# Altium schematic sheet Power_Supply_Schematic.SchDoc
size A4; DocumentNumber: 2; SheetNumber: 2; SheetTotal: 5
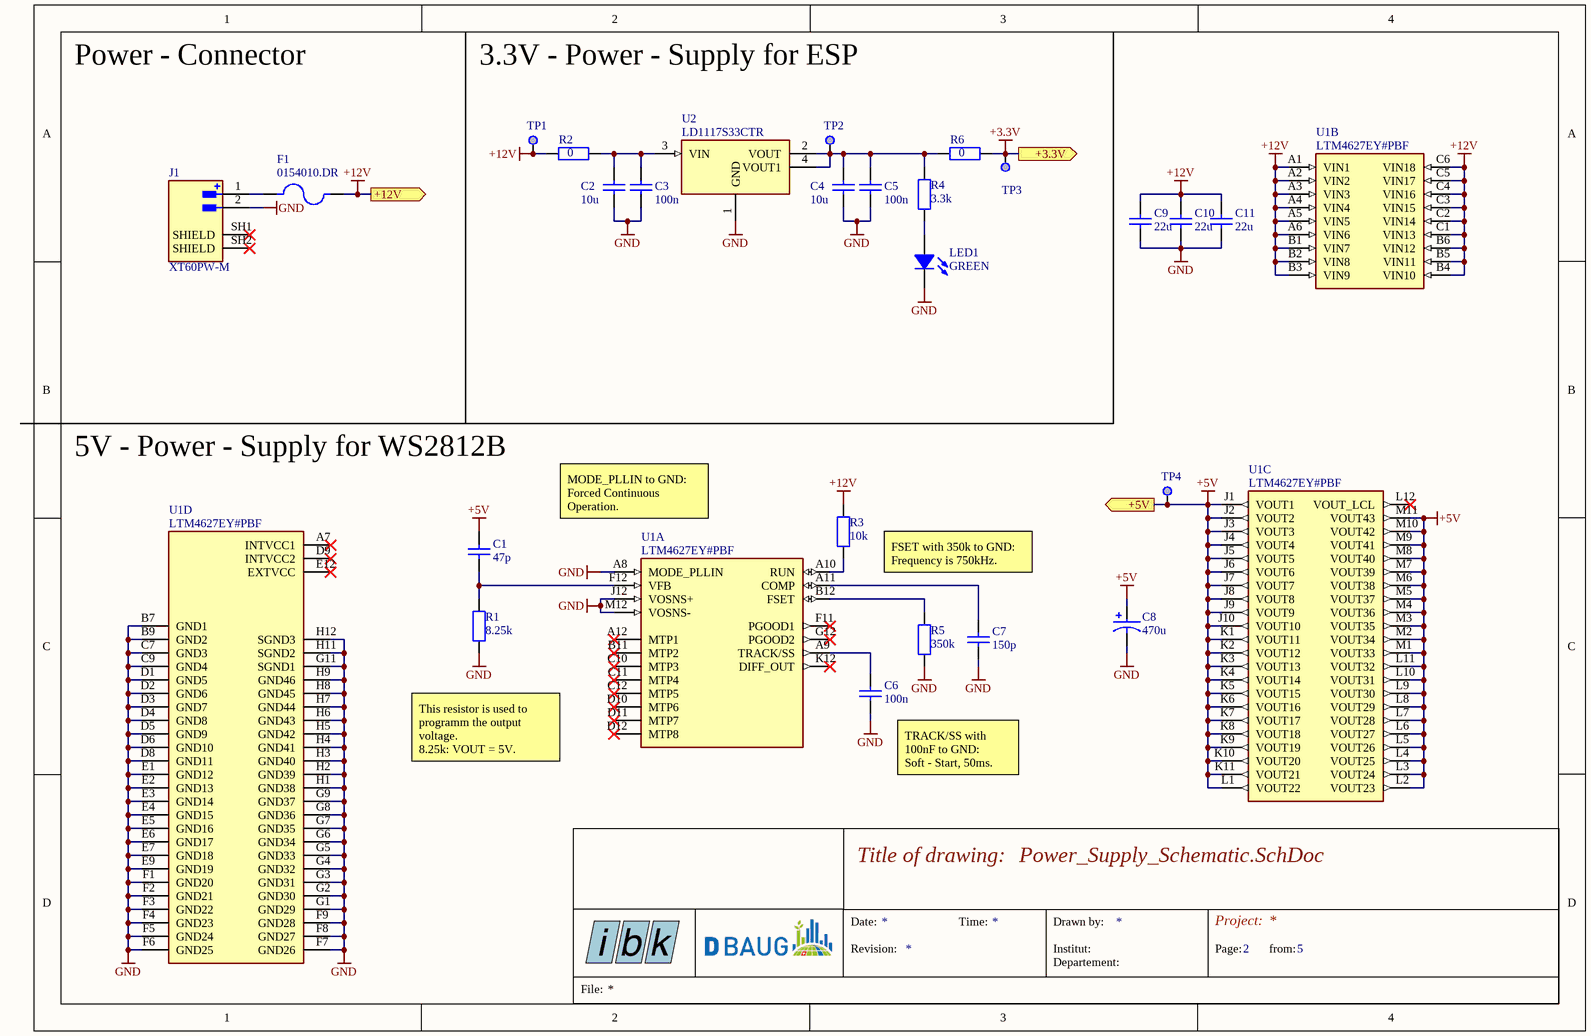
[diagram p0: Power_Supply_Schematic.SchDoc]

## Parts
C1  47p  [0603_CAPACITOR]
C2  10u  [Capacitor_0805]
C3  100n  [0603_CAPACITOR]
C4  10u  [Capacitor_0805]
C5  100n  [0603_CAPACITOR]
C6  100n  [0603_CAPACITOR]
C7  150p  [0603_CAPACITOR]
C8  470u  [Capacitor_Tantalum]
C9  22u  [Capacitor_0805]
C10  22u  [Capacitor_0805]
C11  22u  [Capacitor_0805]
F1  0154010.DR  [Fuse]
J1  XT60PW-M  [PCB_Connector]
LED1  GREEN  [LED_0603, GREEN]
R1  8.25k  [Resistor_0603]
R2  0  [1206_Resistor]
R3  10k  [Resistor_0603]
R4  3.3k  [Resistor_0603]
R5  350k  [Resistor_0603]
R6  0  [1206_Resistor]
TP1  Testpoint S2761-46R  [Testpoint S2761-46R]  (value not drawn)
TP2  Testpoint S2761-46R  [Testpoint S2761-46R]  (value not drawn)
TP3  Testpoint S2761-46R  [Testpoint S2761-46R]  (value not drawn)
TP4  Testpoint S2761-46R  [Testpoint S2761-46R]  (value not drawn)
U1  LTM4627EY#PBF  [DCDC_Converter]  (parts A,B,C,D of 4)
U2  LD1117S33CTR  [LD1117S33CTR]

## Ports
+3.3V (out), +5V (out), +12V (out)

## Nets
+3.3V: R6.2 TP3.1 ; port +3.3V
+5V: C1.2 C8.1 TP4.1 U1.J1(VOUT1) U1.J2(VOUT2) U1.J3(VOUT3) U1.J4(VOUT4) U1.J5(VOUT5) U1.J6(VOUT6) U1.J7(VOUT7) U1.J8(VOUT8) U1.J9(VOUT9) U1.J10(VOUT10) U1.K1(VOUT11) U1.K2(VOUT12) U1.K3(VOUT13) U1.K4(VOUT14) U1.K5(VOUT15) U1.K6(VOUT16) U1.K7(VOUT17) U1.K8(VOUT18) U1.K9(VOUT19) U1.K10(VOUT20) U1.K11(VOUT21) U1.L1(VOUT22) U1.L2(VOUT23) U1.L3(VOUT24) U1.L4(VOUT25) U1.L5(VOUT26) U1.L6(VOUT27) U1.L7(VOUT28) U1.L8(VOUT29) U1.L9(VOUT30) U1.L10(VOUT31) U1.L11(VOUT32) U1.M1(VOUT33) U1.M2(VOUT34) U1.M3(VOUT35) U1.M4(VOUT36) U1.M5(VOUT37) U1.M6(VOUT38) U1.M7(VOUT39) U1.M8(VOUT40) U1.M9(VOUT41) U1.M10(VOUT42) U1.M11(VOUT43) ; port +5V
+12V: C9.2 C10.2 C11.2 F1.2 R2.1 R3.2 TP1.1 U1.A1(VIN1) U1.A2(VIN2) U1.A3(VIN3) U1.A4(VIN4) U1.A5(VIN5) U1.A6(VIN6) U1.B1(VIN7) U1.B2(VIN8) U1.B3(VIN9) U1.B4(VIN10) U1.B5(VIN11) U1.B6(VIN12) U1.C1(VIN13) U1.C2(VIN14) U1.C3(VIN15) U1.C4(VIN16) U1.C5(VIN17) U1.C6(VIN18) ; port +12V
GND: C2.1 C3.1 C4.1 C5.1 C6.1 C7.1 C8.2 C9.1 C10.1 C11.1 J1.2(N) LED1.K R1.1 R5.1 U1.A8(MODE_PLLIN) U1.B7(GND1) U1.B9(GND2) U1.C7(GND3) U1.C9(GND4) U1.D1(GND5) U1.D2(GND6) U1.D3(GND7) U1.D4(GND8) U1.D5(GND9) U1.D6(GND10) U1.D8(GND11) U1.E1(GND12) U1.E2(GND13) U1.E3(GND14) U1.E4(GND15) U1.E5(GND16) U1.E6(GND17) U1.E7(GND18) U1.E9(GND19) U1.F1(GND20) U1.F2(GND21) U1.F3(GND22) U1.F4(GND23) U1.F5(GND24) U1.F6(GND25) U1.F7(GND26) U1.F8(GND27) U1.F9(GND28) U1.G1(GND29) U1.G2(GND30) U1.G3(GND31) U1.G4(GND32) U1.G5(GND33) U1.G6(GND34) U1.G7(GND35) U1.G8(GND36) U1.G9(GND37) U1.G11(SGND1) U1.H1(GND38) U1.H2(GND39) U1.H3(GND40) U1.H4(GND41) U1.H5(GND42) U1.H6(GND43) U1.H7(GND44) U1.H8(GND45) U1.H9(GND46) U1.H11(SGND2) U1.H12(SGND3) U1.J12(VOSNS+) U1.M12(VOSNS-) U2.1(GND)
NetC1_1: C1.1 R1.2 U1.F12(VFB)
NetC2_2: C2.2 C3.2 R2.2 U2.3(VIN)
NetC4_2: C4.2 C5.2 R4.2 R6.1 TP2.1 U2.2(VOUT) U2.4(VOUT1)
NetC6_2: C6.2 U1.A9(TRACK/SS)
NetC7_2: C7.2 U1.A11(COMP)
NetF1_1: F1.1 J1.1(P)
NetLED1_A: LED1.A R4.1
NetR3_1: R3.1 U1.A10(RUN)
NetR5_2: R5.2 U1.B12(FSET)

Not connected (* = marked no-connect by the designer): J1 SH1(SHIELD)* SH2(SHIELD)*; U1 A7(INTVCC1)* A12(MTP1)* B11(MTP2)* C10(MTP3)* C11(MTP4)* C12(MTP5)* D9(INTVCC2)* D10(MTP6)* D11(MTP7)* D12(MTP8)* E12(EXTVCC)* F11(PGOOD1)* G12(PGOOD2)* K12(DIFF_OUT)* L12(VOUT_LCL)*

## Notes on the sheet
- Power - Connector
- 3.3V - Power - Supply for ESP
- 5V - Power - Supply for WS2812B
- MODE_PLLIN to GND:
  Forced Continuous Operation.
- FSET with 350k to GND:
  Frequency is 750kHz.
- This resistor is used to programm the output voltage.
  8.25k: VOUT = 5V.
- (near C6) TRACK/SS with 100nF to GND:
  Soft - Start, 50ms.
- Date:
- Title of drawing:
- Time:
- Drawn by:
- Project:
- Revision:
- Institut:
- Departement:
- Page:
- from:
- File:

## Library data of the parts
C1 C3 C5-C7 = Capacitor: 0603
C2 C4 C9-C11 = Capacitor_0805: 0805
C8 = Capacitor_Tantalum: 470 µF Molded Tantalum Capacitors 6.3 V 2917 (7343 Metric) 100mOhm.
F1 = Fuse: FUSE BRD MNT 10A 125VAC/VDC SMD | Littelfuse 0154010.DR.
J1 = PCB_Connector: Socket, DC supply, male, PIN: 2.; MF: AMASS; SnapEDA_Link: https://www.snapeda.com/parts/XT60PW-M/AMASS/view-part/?ref=snap; Package: Package; Value: *; MP: XT60PW-M; Check_prices: https://www.snapeda.com/parts/XT60PW-M/AMASS/view-part/?ref=eda
LED1 = LED_0603, GREEN: LED 0603, Green, 3.2 V, 20 mA, 430 mcd
R1 R3-R5 = Resistor_0603: 0603
R2 R6 = Resistor_1206: 1206
TP1-TP4 = Testpoint S2761-46R: Prüfstecker und Messbuchsen EZ BoardWare S27 SMT Mini Test Terminal, Reel
U1 = DCDC_Converter: Module DC-DC 1-OUT 0.6V to 5V 15A Automotive 133-Pin BGA Tray.; MF: Analog Devices; SnapEDA_Link: https://www.snapeda.com/parts/LTM4627EY%23PBF/Analog+Devices/view-part/?ref=snap; Availability: In Stock; Purchase-URL: https://pricing.snapeda.com/search/part/LTM4627EY#PBF/?ref=eda; Check_prices: https://www.snapeda.com/parts/LTM4627EY%23PBF/Analog+Devices/view-part/?ref=eda; Value: *; Package: BGA -133 Analog Devices; MP: LTM4627EY#PBF; Price: None
U2 = LD1117S33CTR: LDO, 3.3V and 800mA.; ComponentLink1Description: Datasheet; ComponentLink1URL: chrome-extension://efaidnbmnnnibpcajpcglclefindmkaj/https://www.st.com/content/ccc/resource/technical/document/datasheet/99/3b/7d/91/91/51/4b/be/CD00000544.pdf/files/CD00000544.pdf/jcr:content/translations/en.CD00000544.pdf; ComponentLink2Description: Supplier; ComponentLink2URL: https://www.digikey.ch/en/products/detail/stmicroelectronics/LD1117S33CTR/585765